# Altium schematic sheet Communication.SchDoc
size A4
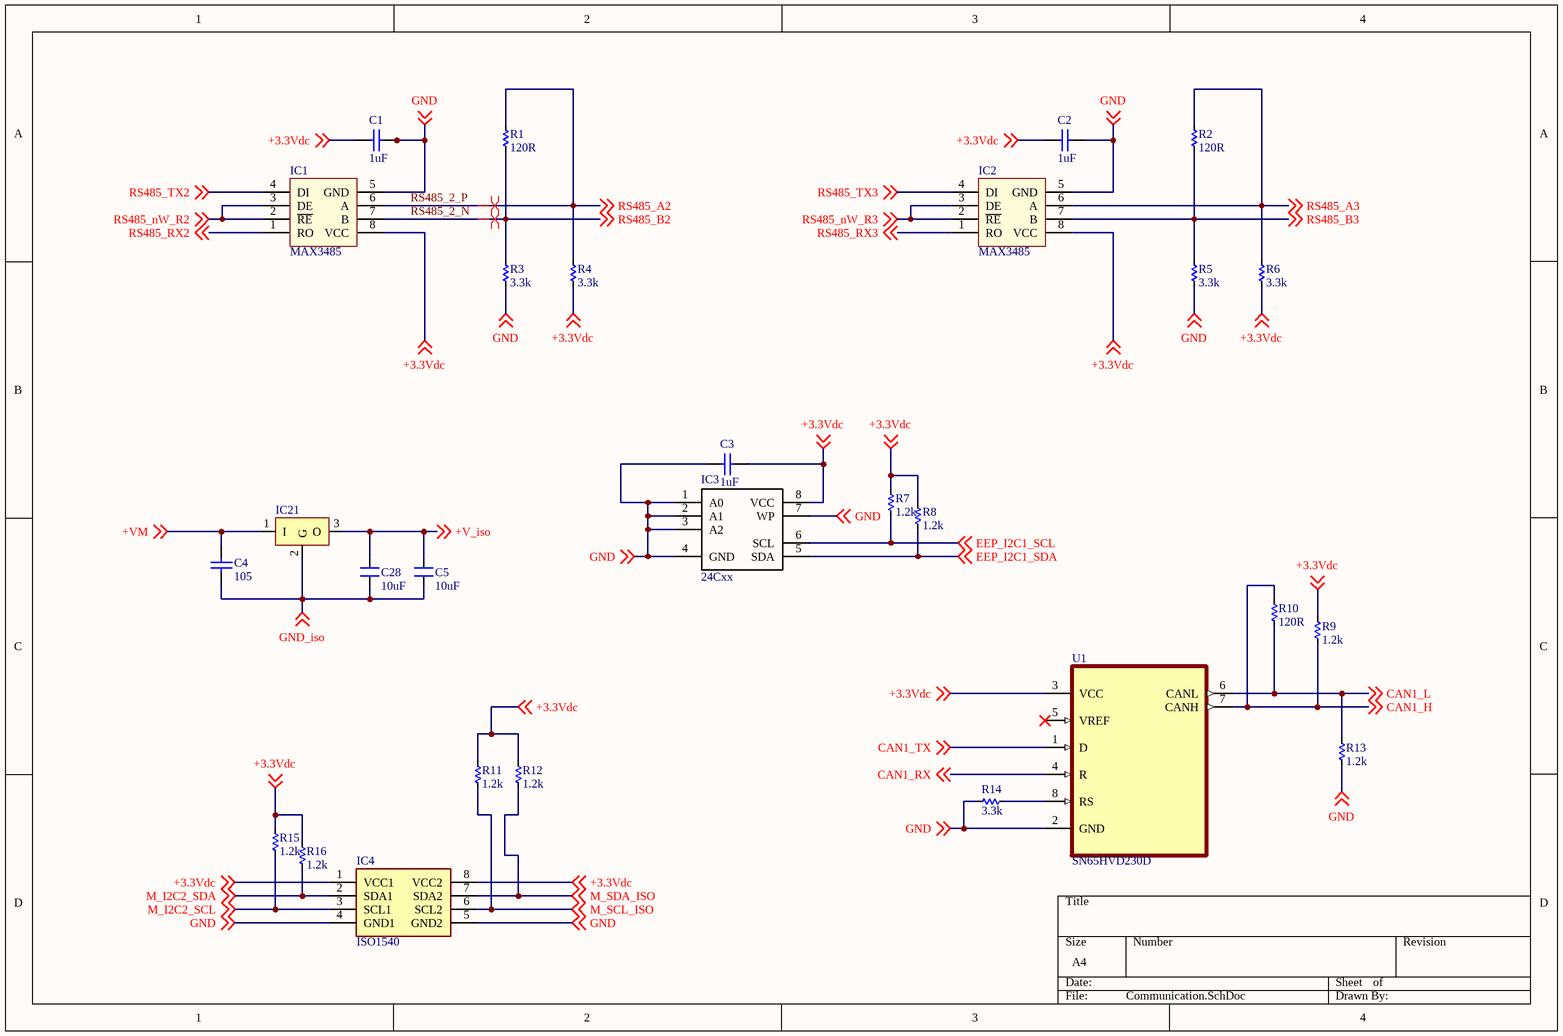
[diagram p0: Communication.SchDoc]

## Parts
C1  1uF  [tu 0603]
C2  1uF  [tu 0603]
C3  1uF  [tu 0603]
C4  105  [tu 1206]
C5  10uF  [CM-0805 capacitor]
C28  10uF  [CM-0805 capacitor]
IC1  MAX3485  [SO8]
IC2  MAX3485  [SO8]
IC3  24Cxx  [SO8]
IC4  ISO1540  [SOIC127P600X175-8N]
IC21  78M05  [TO252-123]  (value not drawn)
R1  120R  [RES-SMD-0603]
R2  120R  [RES-SMD-0603]
R3  3.3k  [RES-SMD-0603]
R4  3.3k  [RES-SMD-0603]
R5  3.3k  [RES-SMD-0603]
R6  3.3k  [RES-SMD-0603]
R7  1.2k  [RES-SMD-0603]
R8  1.2k  [RES-SMD-0603]
R9  1.2k  [RES-SMD-0603]
R10  120R  [RES-SMD-0603]
R11  1.2k  [RES-SMD-0603]
R12  1.2k  [RES-SMD-0603]
R13  1.2k  [RES-SMD-0603]
R14  3.3k  [RES-SMD-0603]
R15  1.2k  [RES-SMD-0603]
R16  1.2k  [RES-SMD-0603]
U1  SN65HVD230D  [SO8]

## Nets
+3.3Vdc: C1.1 C2.1 C3.2 IC1.8(VCC) IC2.8(VCC) IC3.8(VCC) IC4.1(VCC1) IC4.8(VCC2) R4.2 R6.2 R7.1 R8.1 R9.1 R11.1 R12.1 R15.1 R16.1 U1.3(VCC) ; off-sheet +3.3Vdc
+V_iso: C5.2 C28.1 IC21.3(O) ; off-sheet +V_iso
+VM: C4.1 IC21.1(I) ; off-sheet +VM
CAN1_H: R9.2 R10.1 U1.7(CANH) ; off-sheet CAN1_H
CAN1_L: R10.2 R13.1 U1.6(CANL) ; off-sheet CAN1_L
CAN1_RX: U1.4(R) ; off-sheet CAN1_RX
CAN1_TX: U1.1(D) ; off-sheet CAN1_TX
EEP_I2C1_SCL: IC3.6(SCL) R7.2 ; off-sheet EEP_I2C1_SCL
EEP_I2C1_SDA: IC3.5(SDA) R8.2 ; off-sheet EEP_I2C1_SDA
GND: C1.2 C2.2 C3.1 IC1.5(GND) IC2.5(GND) IC3.1(A0) IC3.2(A1) IC3.3(A2) IC3.4(GND) IC3.7(WP) IC4.4(GND1) IC4.5(GND2) R3.2 R5.2 R13.2 R14.1 U1.2(GND) ; off-sheet GND
GND_iso: C4.2 C5.1 C28.2 IC21.2(G) ; off-sheet GND_iso
M_I2C2_SCL: IC4.3(SCL1) R15.2 ; off-sheet M_I2C2_SCL
M_I2C2_SDA: IC4.2(SDA1) R16.2 ; off-sheet M_I2C2_SDA
M_SCL_ISO: IC4.6(SCL2) R11.2 ; off-sheet M_SCL_ISO
M_SDA_ISO: IC4.7(SDA2) R12.2 ; off-sheet M_SDA_ISO
RS485_2_N: IC1.7(B) R1.2 R3.1 ; off-sheet RS485_B2  [also labelled RS485_B2]
RS485_2_P: IC1.6(A) R1.1 R4.1 ; off-sheet RS485_A2  [also labelled RS485_A2]
RS485_A3: IC2.6(A) R2.1 R6.1 ; off-sheet RS485_A3
RS485_B3: IC2.7(B) R2.2 R5.1 ; off-sheet RS485_B3
RS485_nW_R2: IC1.2(~{RE}) IC1.3(DE) ; off-sheet RS485_nW_R2
RS485_nW_R3: IC2.2(~{RE}) IC2.3(DE) ; off-sheet RS485_nW_R3
RS485_RX2: IC1.1(RO) ; off-sheet RS485_RX2
RS485_RX3: IC2.1(RO) ; off-sheet RS485_RX3
RS485_TX2: IC1.4(DI) ; off-sheet RS485_TX2
RS485_TX3: IC2.4(DI) ; off-sheet RS485_TX3
NetR14_2: R14.2 U1.8(RS)

Not connected (* = marked no-connect by the designer): U1 5(VREF)*

## Layout directives
differential pair: RS485_2_N, RS485_2_P

## Library data of the parts
C1-C3 = Tu 0603 102 50V 10%: Dán; Don_Vi: Con; So_Chan: 2; Ten_Linh_Kien: Tụ 0603 102-1nF 10% 50V; Ma_Hang: MH004566; Chung_Loai: Dán; Kieu_Chan: *
C4 = Tu 1206 105 50V 20%: Dán; Don_Vi: Con; So_Chan: 2; Ten_Linh_Kien: Tụ 1206 105-1uF 20% 50V; Ma_Hang: MH004545; Chung_Loai: Dán; Kieu_Chan: *
C5 C28 = CN: 0805_SMD_20pF; Value: 100pF
IC1 IC2 = MAX485: RS232 - RS485 (Same sn75176)
IC3 = 24Cxx: Standard 2-Wire Bus Interface Serial EEPROM; Value: DIP 8; Value: 24Cxx; Copyright by: VanDungEvn
IC4 = HPA02222DR: Integrated Circuit; Manufacturer_Name: Texas Instruments; Datasheet Link: http://www.ti.com/general/docs/suppproductinfo.tsp?distId=26&gotoUrl=http%3A%2F%2Fwww.ti.com%2Flit%2Fgpn%2Fiso1540; Height: 1.75mm; Manufacturer_Part_Number: HPA02222DR; Mouser Part Number: 595-HPA02222DR; Mouser Price/Stock: https://www.mouser.co.uk/ProductDetail/Texas-Instruments/HPA02222DR?qs=CinXaP2cUj2opC1RRUOhNg%3D%3D
IC21 = LM78xx: Positive Voltage Regulator; Note: Tab is connected to pin 3 (GND).; Published: 24-Aug-2001; LatestRevisionDate: 17-Jul-2002; LatestRevisionNote: Re-released for DXP Platform.; DatasheetVersion: Apr-1994; PackageVersion: Jul-1998; PackageReference: ISOWATT220AB; Publisher: Altium Limited; PackageDescription: TO, Thru-Hole, Vertical, Heatsink Mounted; 3 In-Line Leads; Pitch 2.54 mm; Pin sequence 1, 3, 2; ComponentLink1Description: Manufacturer Link; ComponentLink1URL: http://www.st.com/; ComponentLink2Description: Datasheet; ComponentLink2URL: http://www.st.com/stonline/products/literature/ds/2146/l78m05c.pdf
R1-R16 = Res-SMD: Resistor; Manufacturer: Generic Components; Class: Passive; Published: 08/06/2000; Publisher: Altium Hobart Technology Centre
U1 = SN65HVD230D: 1/1 Transceiver Half CANbus 8-SOIC; MF: Texas Instruments; Digi-Key_Purchase_URL: https://www.digikey.de/product-detail/en/texas-instruments/SN65HVD230D/SN65HVD230D-ND/1574496?utm_source=snapeda&utm_medium=aggregator&utm_campaign=symbol; Digi-Key_Part_Number: SN65HVD230D-ND; SnapEDA_Link: https://www.snapeda.com/parts/SN65HVD230D/Texas%20Instruments/view-part/51766/?ref=snap; Package: SOIC-8 Texas Instruments; Value: *; MP: SN65HVD230D